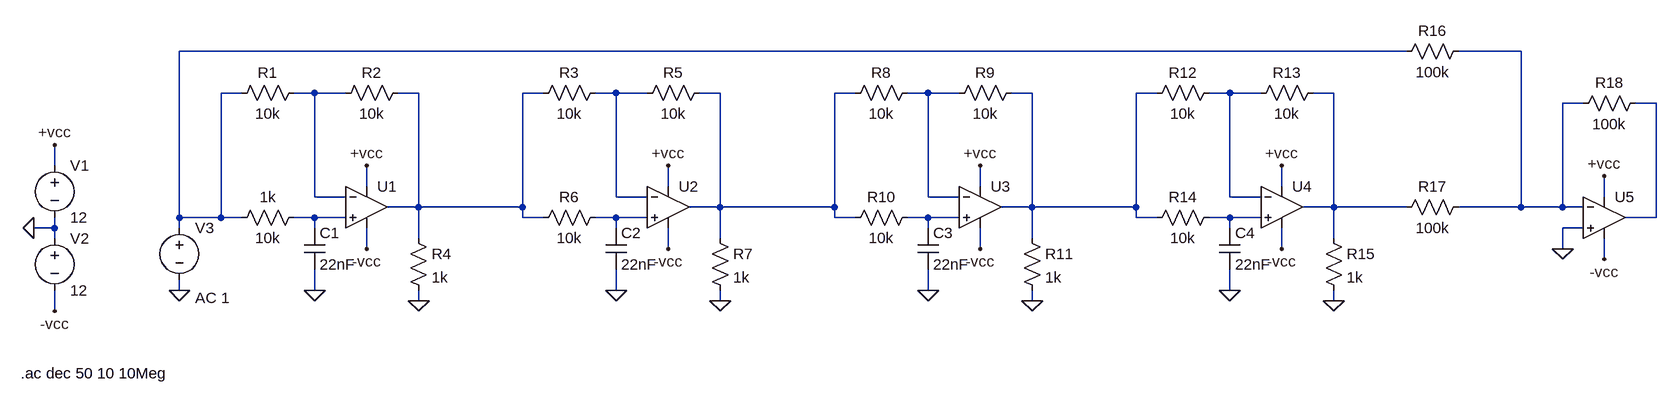
[diagram p0: schematic phaser.asc]
phaser.asc, the LTspice schematic file:
Version 4
SHEET 1 2228 680
WIRE 1840 -112 -48 -112
WIRE 2016 -112 1920 -112
WIRE 48 -48 16 -48
WIRE 160 -48 128 -48
WIRE 208 -48 160 -48
WIRE 320 -48 288 -48
WIRE 512 -48 480 -48
WIRE 624 -48 592 -48
WIRE 672 -48 624 -48
WIRE 784 -48 752 -48
WIRE 992 -48 960 -48
WIRE 1104 -48 1072 -48
WIRE 1152 -48 1104 -48
WIRE 1264 -48 1232 -48
WIRE 1456 -48 1424 -48
WIRE 1568 -48 1536 -48
WIRE 1616 -48 1568 -48
WIRE 1728 -48 1696 -48
WIRE 2112 -32 2080 -32
WIRE 2224 -32 2192 -32
WIRE -240 64 -240 32
WIRE 240 96 240 64
WIRE 704 96 704 64
WIRE 1184 96 1184 64
WIRE 1648 96 1648 64
WIRE 160 112 160 -48
WIRE 208 112 160 112
WIRE 624 112 624 -48
WIRE 672 112 624 112
WIRE 1104 112 1104 -48
WIRE 1152 112 1104 112
WIRE 1568 112 1568 -48
WIRE 1616 112 1568 112
WIRE 2144 112 2144 80
WIRE 320 128 320 -48
WIRE 320 128 272 128
WIRE 480 128 480 -48
WIRE 480 128 320 128
WIRE 784 128 784 -48
WIRE 784 128 736 128
WIRE 960 128 960 -48
WIRE 960 128 784 128
WIRE 1264 128 1264 -48
WIRE 1264 128 1216 128
WIRE 1424 128 1424 -48
WIRE 1424 128 1264 128
WIRE 1728 128 1728 -48
WIRE 1728 128 1680 128
WIRE 1840 128 1728 128
WIRE 2016 128 2016 -112
WIRE 2016 128 1920 128
WIRE 2080 128 2080 -32
WIRE 2080 128 2016 128
WIRE 2112 128 2080 128
WIRE -48 144 -48 -112
WIRE 16 144 16 -48
WIRE 16 144 -48 144
WIRE 48 144 16 144
WIRE 160 144 128 144
WIRE 208 144 160 144
WIRE 480 144 480 128
WIRE 512 144 480 144
WIRE 624 144 592 144
WIRE 672 144 624 144
WIRE 960 144 960 128
WIRE 992 144 960 144
WIRE 1104 144 1072 144
WIRE 1152 144 1104 144
WIRE 1424 144 1424 128
WIRE 1456 144 1424 144
WIRE 1568 144 1536 144
WIRE 1616 144 1568 144
WIRE 2224 144 2224 -32
WIRE 2224 144 2176 144
WIRE -240 160 -240 144
WIRE -240 160 -272 160
WIRE -48 160 -48 144
WIRE 160 160 160 144
WIRE 624 160 624 144
WIRE 1104 160 1104 144
WIRE 1568 160 1568 144
WIRE 2112 160 2080 160
WIRE -240 176 -240 160
WIRE 320 176 320 128
WIRE 784 176 784 128
WIRE 1264 176 1264 128
WIRE 1728 176 1728 128
WIRE 240 192 240 160
WIRE 704 192 704 160
WIRE 1184 192 1184 160
WIRE 1648 192 1648 160
WIRE 2080 192 2080 160
WIRE 2144 208 2144 176
WIRE -48 256 -48 240
WIRE 160 256 160 224
WIRE 624 256 624 224
WIRE 1104 256 1104 224
WIRE 1568 256 1568 224
WIRE 320 272 320 256
WIRE 784 272 784 256
WIRE 1264 272 1264 256
WIRE 1728 272 1728 256
WIRE -240 288 -240 256
FLAG -240 32 +vcc
FLAG -272 160 0
FLAG -240 288 -vcc
FLAG 240 64 +vcc
FLAG 240 192 -vcc
FLAG 320 272 0
FLAG 160 256 0
FLAG -48 256 0
FLAG 704 64 +vcc
FLAG 704 192 -vcc
FLAG 784 272 0
FLAG 624 256 0
FLAG 1184 64 +vcc
FLAG 1184 192 -vcc
FLAG 1264 272 0
FLAG 1104 256 0
FLAG 1648 64 +vcc
FLAG 1648 192 -vcc
FLAG 1728 272 0
FLAG 1568 256 0
FLAG 2144 80 +vcc
FLAG 2144 208 -vcc
FLAG 2080 192 0
SYMBOL OpAmps\\UniversalOpAmp2 240 128 R0
SYMATTR InstName U1
SYMBOL voltage -240 48 R0
WINDOW 123 0 0 Left 0
WINDOW 39 0 0 Left 0
SYMATTR InstName V1
SYMATTR Value 12
SYMBOL voltage -240 160 R0
WINDOW 123 0 0 Left 0
WINDOW 39 0 0 Left 0
SYMATTR InstName V2
SYMATTR Value 12
SYMBOL res 144 -64 R90
WINDOW 0 0 56 VBottom 2
WINDOW 3 32 56 VTop 2
SYMATTR InstName R1
SYMATTR Value 10k
SYMBOL res 304 -64 R90
WINDOW 0 0 56 VBottom 2
WINDOW 3 32 56 VTop 2
SYMATTR InstName R2
SYMATTR Value 10k
SYMBOL res 144 128 R90
WINDOW 0 0 56 VBottom 2
WINDOW 3 32 56 VTop 2
SYMATTR InstName 1k
SYMATTR Value 10k
SYMBOL res 304 160 R0
SYMATTR InstName R4
SYMATTR Value 1k
SYMBOL cap 144 160 R0
SYMATTR InstName C1
SYMATTR Value 22nF
SYMBOL voltage -48 144 R0
WINDOW 123 24 124 Left 2
WINDOW 39 0 0 Left 0
SYMATTR InstName V3
SYMATTR Value ""
SYMATTR Value2 AC 1
SYMBOL OpAmps\\UniversalOpAmp2 704 128 R0
SYMATTR InstName U2
SYMBOL res 608 -64 R90
WINDOW 0 0 56 VBottom 2
WINDOW 3 32 56 VTop 2
SYMATTR InstName R3
SYMATTR Value 10k
SYMBOL res 768 -64 R90
WINDOW 0 0 56 VBottom 2
WINDOW 3 32 56 VTop 2
SYMATTR InstName R5
SYMATTR Value 10k
SYMBOL res 608 128 R90
WINDOW 0 0 56 VBottom 2
WINDOW 3 32 56 VTop 2
SYMATTR InstName R6
SYMATTR Value 10k
SYMBOL res 768 160 R0
SYMATTR InstName R7
SYMATTR Value 1k
SYMBOL cap 608 160 R0
SYMATTR InstName C2
SYMATTR Value 22nF
SYMBOL OpAmps\\UniversalOpAmp2 1184 128 R0
SYMATTR InstName U3
SYMBOL res 1088 -64 R90
WINDOW 0 0 56 VBottom 2
WINDOW 3 32 56 VTop 2
SYMATTR InstName R8
SYMATTR Value 10k
SYMBOL res 1248 -64 R90
WINDOW 0 0 56 VBottom 2
WINDOW 3 32 56 VTop 2
SYMATTR InstName R9
SYMATTR Value 10k
SYMBOL res 1088 128 R90
WINDOW 0 0 56 VBottom 2
WINDOW 3 32 56 VTop 2
SYMATTR InstName R10
SYMATTR Value 10k
SYMBOL res 1248 160 R0
SYMATTR InstName R11
SYMATTR Value 1k
SYMBOL cap 1088 160 R0
SYMATTR InstName C3
SYMATTR Value 22nF
SYMBOL OpAmps\\UniversalOpAmp2 1648 128 R0
SYMATTR InstName U4
SYMBOL res 1552 -64 R90
WINDOW 0 0 56 VBottom 2
WINDOW 3 32 56 VTop 2
SYMATTR InstName R12
SYMATTR Value 10k
SYMBOL res 1712 -64 R90
WINDOW 0 0 56 VBottom 2
WINDOW 3 32 56 VTop 2
SYMATTR InstName R13
SYMATTR Value 10k
SYMBOL res 1552 128 R90
WINDOW 0 0 56 VBottom 2
WINDOW 3 32 56 VTop 2
SYMATTR InstName R14
SYMATTR Value 10k
SYMBOL res 1712 160 R0
SYMATTR InstName R15
SYMATTR Value 1k
SYMBOL cap 1552 160 R0
SYMATTR InstName C4
SYMATTR Value 22nF
SYMBOL OpAmps\\UniversalOpAmp2 2144 144 R0
SYMATTR InstName U5
SYMBOL res 1936 -128 R90
WINDOW 0 0 56 VBottom 2
WINDOW 3 32 56 VTop 2
SYMATTR InstName R16
SYMATTR Value 100k
SYMBOL res 1936 112 R90
WINDOW 0 0 56 VBottom 2
WINDOW 3 32 56 VTop 2
SYMATTR InstName R17
SYMATTR Value 100k
SYMBOL res 2208 -48 R90
WINDOW 0 0 56 VBottom 2
WINDOW 3 32 56 VTop 2
SYMATTR InstName R18
SYMATTR Value 100k
TEXT -292 384 Left 2 !.ac dec 50 10 10Meg

The netlist it stands for:
* phaser.asc
XU1 N012 N003 +vcc -vcc N004 level2 Avol=1Meg GBW=10Meg Slew=10Meg Ilimit=25m Rail=0 Vos=0 En=0 Enk=0 In=0 Ink=0 Rin=500Meg  ; pins In+ In- V+ V- OUT
V1 +vcc 0 12
V2 0 -vcc 12
R1 N003 N001 10k
R2 N004 N003 10k
R§1k N012 N001 10k
R4 N004 0 1k
C1 N012 0 22nF
V3 N001 0 AC 1
XU2 N013 N005 +vcc -vcc N006 level2 Avol=1Meg GBW=10Meg Slew=10Meg Ilimit=25m Rail=0 Vos=0 En=0 Enk=0 In=0 Ink=0 Rin=500Meg  ; pins In+ In- V+ V- OUT
R3 N005 N004 10k
R5 N006 N005 10k
R6 N013 N004 10k
R7 N006 0 1k
C2 N013 0 22nF
XU3 N014 N007 +vcc -vcc N008 level2 Avol=1Meg GBW=10Meg Slew=10Meg Ilimit=25m Rail=0 Vos=0 En=0 Enk=0 In=0 Ink=0 Rin=500Meg  ; pins In+ In- V+ V- OUT
R8 N007 N006 10k
R9 N008 N007 10k
R10 N014 N006 10k
R11 N008 0 1k
C3 N014 0 22nF
XU4 N015 N009 +vcc -vcc N010 level2 Avol=1Meg GBW=10Meg Slew=10Meg Ilimit=25m Rail=0 Vos=0 En=0 Enk=0 In=0 Ink=0 Rin=500Meg  ; pins In+ In- V+ V- OUT
R12 N009 N008 10k
R13 N010 N009 10k
R14 N015 N008 10k
R15 N010 0 1k
C4 N015 0 22nF
XU5 0 N002 +vcc -vcc N011 level2 Avol=1Meg GBW=10Meg Slew=10Meg Ilimit=25m Rail=0 Vos=0 En=0 Enk=0 In=0 Ink=0 Rin=500Meg  ; pins In+ In- V+ V- OUT
R16 N002 N001 100k
R17 N002 N010 100k
R18 N011 N002 100k
.ac dec 50 10 10Meg
.lib UniversalOpAmp2.lib
.backanno
.end